# EAGLE design 2023_ROBOCON_A_SUB (EAGLE 9.6.2)
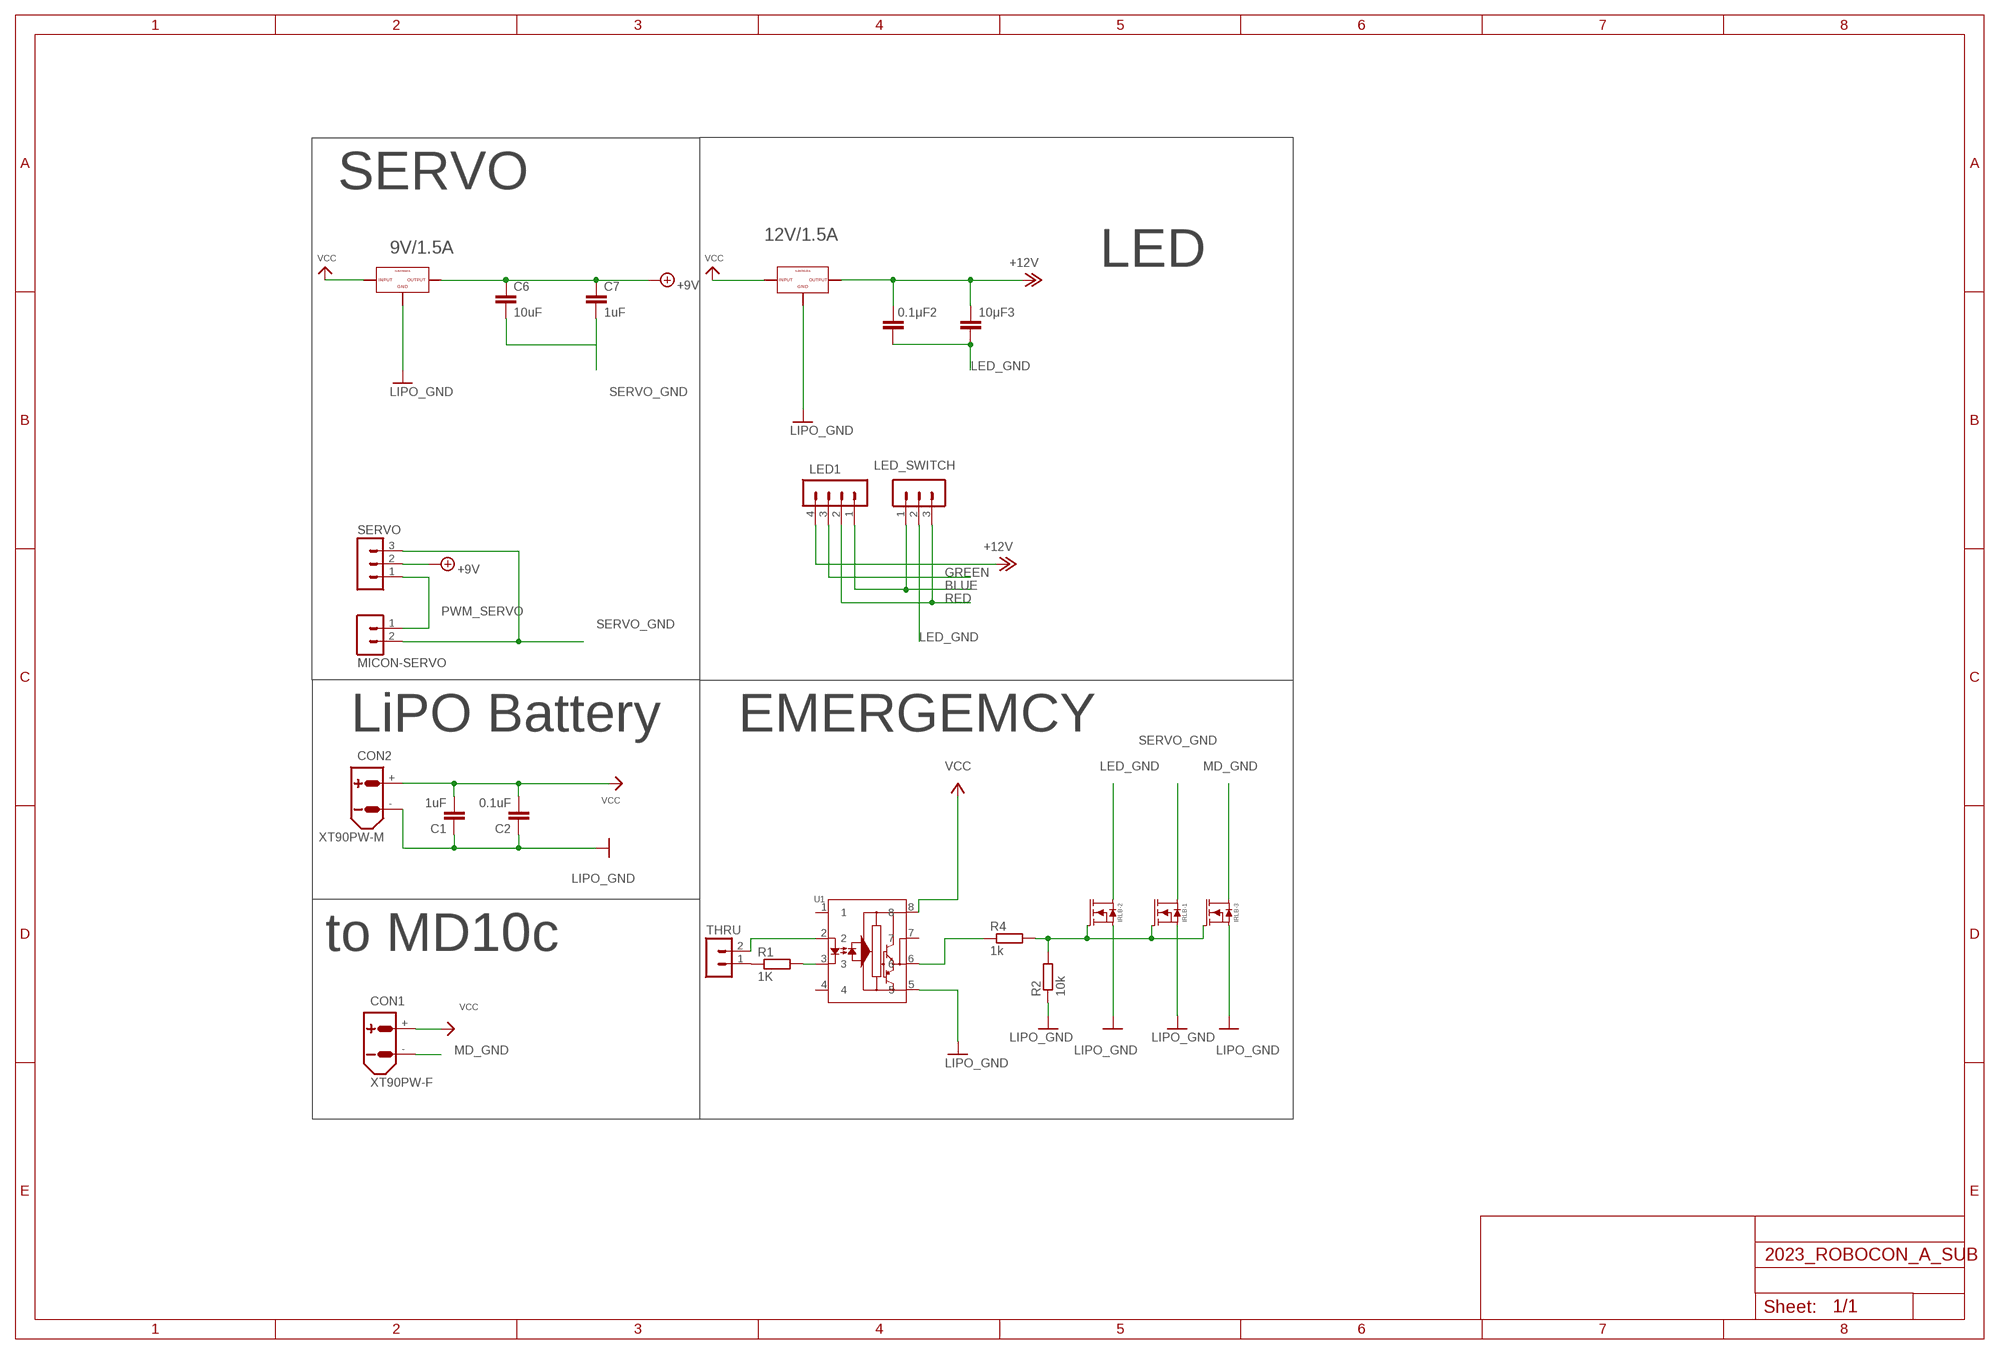
[diagram p0: schematic, sheet 1]

## Parts
0.1μF2  C2,5-3  [C2.5-3]
10μF3  C2,5-3  [C2.5-3]
C1  1uF  C2,5-3  [C2.5-3]
C2  0.1uF  C2,5-3  [C2.5-3]
C6  10uF  C2,5-3  [C2.5-3]
C7  1uF  C2,5-3  [C2.5-3]
CON1  XT90PW-F  [XT90PW-F]
CON2  XT90PW-M  [XT90PW-M]
IRLB-1  IRLB3813STAND  [TO-220AB-STAND]
IRLB-2  IRLB3813STAND  [TO-220AB-STAND]
IRLB-3  IRLB3813STAND  [TO-220AB-STAND]
LED1  04-JST  [B4B-XH]
LED_SWITCH  03-JST  [B3B-XH]
MICON-SERVO  02-JST  [B2B-XH]
R1  1K  R-EU_0204/5  [0204/5]
R2  10k  R-EU_0207/7  [0207/7]
R4  1k  R-EU_0207/7  [0207/7]
SERVO  03-JST  [B3B-XH]
THRU  02-JST  [B2B-XH]
U1  TLP-250  [DIP8_TLP250_6P4X9P66_TOS]
U$4  NJM7812FA  [NJM7812FA]
U$7  NJM7809FA  [NJM7809FA]

## Nets
+9V: C6.1 C7.1 SERVO.2 U$7.OUTPUT
+12V: 0.1μF2.1 10μF3.1 LED1.4 U$4.OUTPUT
BLUE: LED1.1 LED_SWITCH.1
GND: C1.1 C2.1 CON2.- IRLB-1.S IRLB-2.S IRLB-3.S R2.1 U1.5 U$4.GND U$7.GND ; supply symbol labelled LIPO_GND
GREEN: LED1.3
LED_GND: 0.1μF2.2 10μF3.2 IRLB-2.D LED_SWITCH.2
MD_GND: CON1.- IRLB-3.D
N$2: R1.1 THRU.1
N$4: R4.1 U1.6
N$5: R1.2 U1.3
N$7: IRLB-1.G IRLB-2.G IRLB-3.G R2.2 R4.2
N$10: THRU.2 U1.2
PWM_SERVO: MICON-SERVO.1 SERVO.1
RED: LED1.2 LED_SWITCH.3
SERVO_GND: C6.2 C7.2 IRLB-1.D MICON-SERVO.2 SERVO.3
VCC: C1.2 C2.2 CON1.+ CON2.+ U1.8 U$4.INPUT U$7.INPUT
Unconnected: U1.1 U1.4 U1.7

## Notes on the sheet
- SERVO
- 12V/1.5A
- 9V/1.5A
- LED
- LiPO Battery | EMERGEMCY
- to MD10c

## Library data of the parts
0.1μF2 10μF3 C1 C2 C6 C7 = capacitor-wima:C: CAPACITOR naming: grid - package width
CON1 CON2 = amass:XT90: AMASS XT90 connector Store in Japan AMASS XT90 connector <https://szc.jp/ams-xt90>
IRLB-1-IRLB-3 = OKUDA_libraries:IRLB3813
LED1 = con-jst-xh_1:04-JST: JST CONNECTOR
LED_SWITCH = con-jst-xh_1:03-JST: JST CONNECTOR
MICON-SERVO = con-jst-xh (4):02-JST: JST CONNECTOR
R1 R2 R4 = resistor:R-EU_: RESISTOR, European symbol
SERVO = con-jst-xh (4):03-JST: JST CONNECTOR
THRU = con-jst-xh_1:02-JST: JST CONNECTOR
U1 = tlp250:TLP-250; COPYRIGHT: Copyright (C) 2023 Ultra Librarian. All rights reserved.; MANUFACTURER_PART_NUMBER: TLP-250; MFR_NAME: Toshiba Electronic Devices & Storage Corp.
U$4 = NJM7812FA:NJM7812FA
U$7 = NJM7809FA:NJM7809FA

## Board
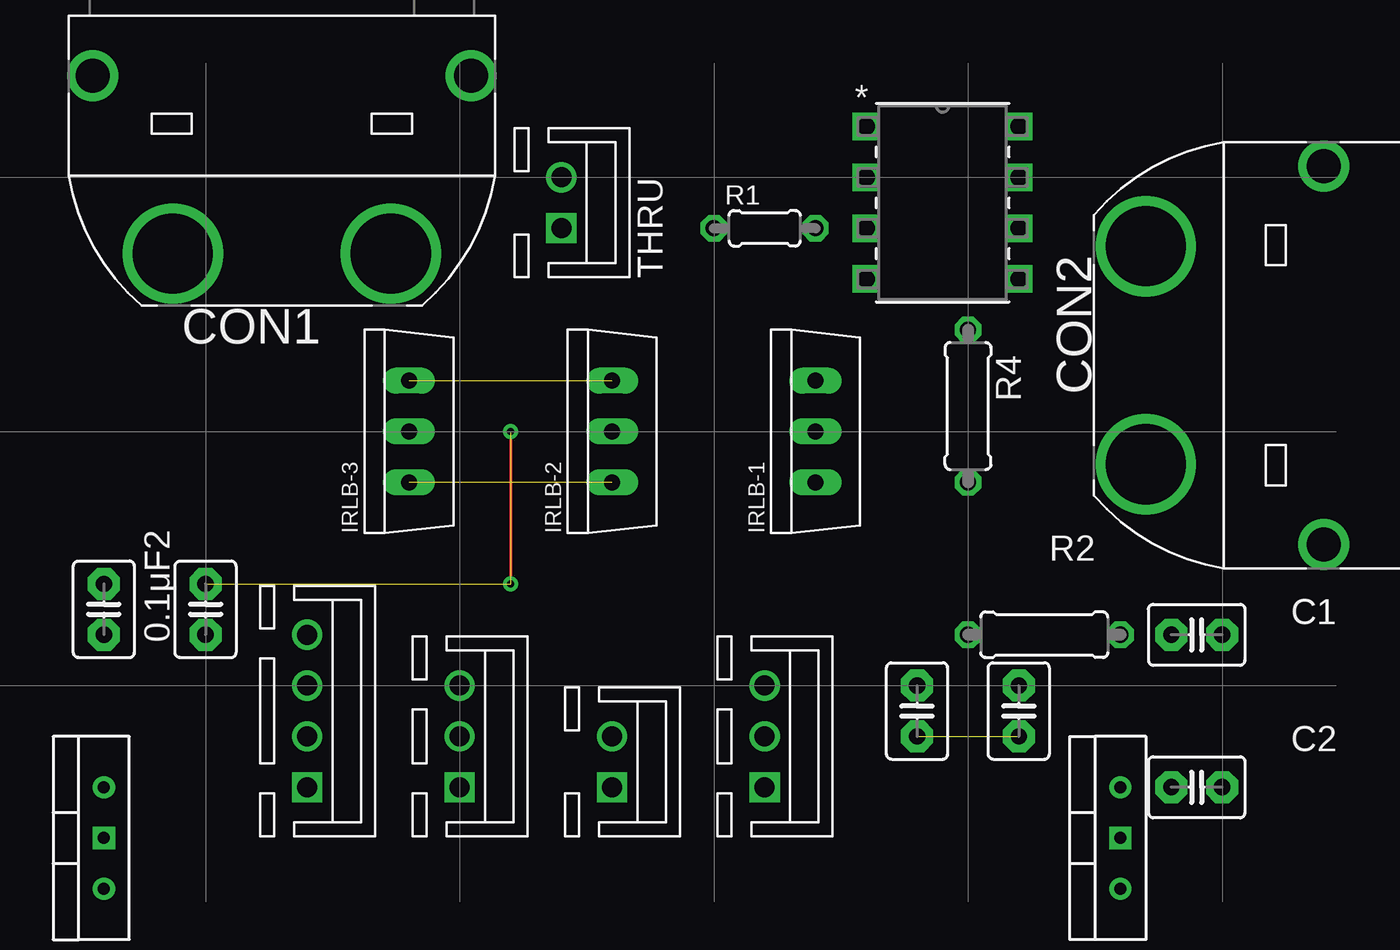
[diagram p1: board, top side]
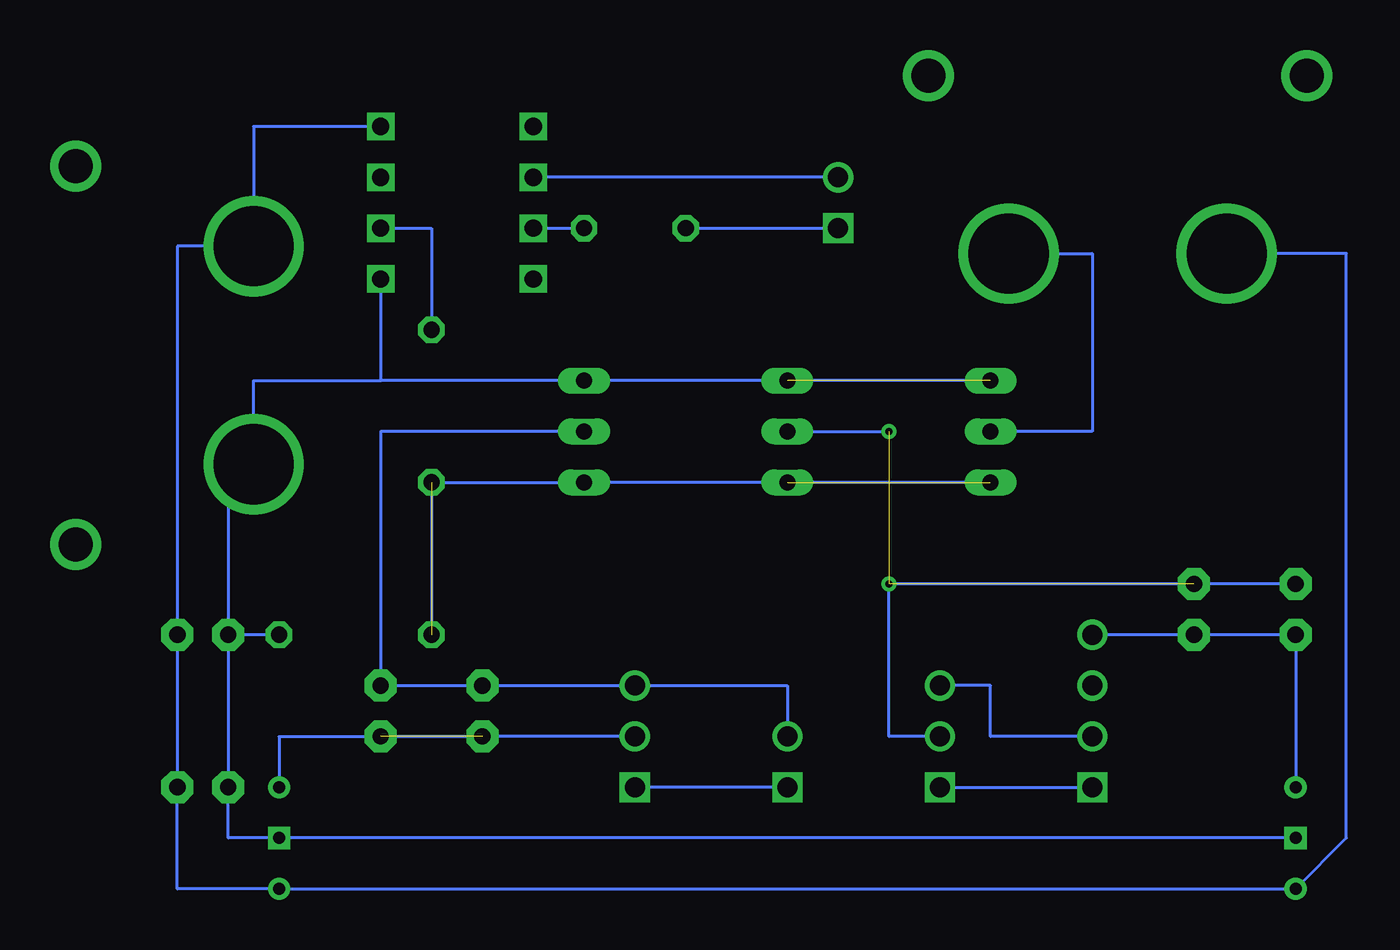
[diagram p2: board, bottom side, seen from below]

No outline drawn. Coordinates in mm, seen from the top.
Copper layers (1*16): Top 0.035mm / dielectric 1.5mm / Bottom 0.035mm
Design rules "default": minimum track width 6mil, minimum drill 0.35mm, track to track 6mil, track to pad 6mil, pad to pad 6mil, via to via 6mil, smd to smd 6mil, copper to edge 40mil, drill to drill 6mil, minimum pad ring 10mil, minimum via ring 8mil, stop-mask expansion 4mil, vias tented up to drill 0mil, thermal gap 10mil

### Footprints (pad centres in the part's own frame; a part is rotated, then mirrored left to right if it is on the bottom)
C2.5-3 = drill 0.813 pad 1.6 octagon: 1 -1.27,0; 2 1.27,0
XT90PW-F = drill 4: + -5.45,0; - 5.45,0 | drill 1.7: P$3 -9.45,8.9; P$4 9.45,8.9
XT90PW-M = drill 4: + -5.45,0; - 5.45,0 | drill 1.7: P$3 -9.45,8.9; P$4 9.45,8.9
TO-220AB-STAND = drill 0.8 long: D 0,0; G -2.54,0; S 2.54,0
B4B-XH = drill 1 square: 1 3.81,0 | drill 1: 2 1.27,0; 3 -1.27,0; 4 -3.81,0
B3B-XH = drill 1 square: 1 2.54,0 | drill 1: 2 0,0; 3 -2.54,0
B2B-XH = drill 1 square: 1 1.27,0 | drill 1: 2 -1.27,0
0204/5 = drill 0.813 octagon: 1 -2.54,0; 2 2.54,0
0207/7 = drill 0.813 octagon: 1 -3.81,0; 2 3.81,0
DIP8_TLP250_6P4X9P66_TOS = drill 0.864 pad 1.372 square: 1 0,0; 2 0,-2.54; 3 0,-5.08; 4 0,-7.62; 5 7.62,-7.62; 6 7.62,-5.08; 7 7.62,-2.54; 8 7.62,0
NJM7812FA = drill 0.6 square: GND 0,0 | drill 0.6: INPUT -2.54,0; OUTPUT 2.54,0
NJM7809FA = drill 0.6 square: GND 0,0 | drill 0.6: INPUT -2.54,0; OUTPUT 2.54,0

### Placement (x,y rotation side)
0.1μF2  158.75,27.94 90 top
10μF3  153.67,27.94 90 top
C1  208.28,26.67 0 top
C2  208.28,19.05 0 top
C6  199.39,22.86 90 top
C7  194.31,22.86 90 top
CON1  162.56,45.72 0 top
CON2  205.74,40.64 270 top
IRLB-1  189.23,36.83 90 top
IRLB-2  179.07,36.83 90 top
IRLB-3  168.91,36.83 90 top
LED1  163.83,22.86 270 top
LED_SWITCH  171.45,21.59 270 top
MICON-SERVO  179.07,20.32 270 top
R1  186.69,46.99 0 top
R2  200.66,26.67 180 top
R4  196.85,38.1 270 top
SERVO  186.69,21.59 270 top
THRU  176.53,48.26 270 top
U1  191.77,52.07 0 top
U$3  [TYPE.C]  146.05,11.43 0 top
U$4  153.67,16.51 90 top
U$7  204.47,16.51 90 top

### Tracks (layer width: path | path; a pad name or v marks a point on that pad's centre or on a via)
+9V  (1 unrouted)
  Bottom 0.152: U$7.OUTPUT 204.47,21.59 C7.1 SERVO.2
+12V
  Bottom 0.152: U$4.OUTPUT 10μF3.1 0.1μF2.1 LED1.4
BLUE
  Bottom 0.152: LED_SWITCH.1 LED1.1
GND  (1 unrouted)
  Bottom 0.152: U1.5 199.39,39.37 | 199.39,39.37 205.74,39.37 CON2.- 205.74,35.56 207.01,35.56 C1.1 | IRLB-3.S IRLB-1.S 199.39,39.37 | R2.1 C1.1 | C1.1 C2.1 207.01,16.51 U$7.GND U$4.GND
LED_GND  (via drill 0.35)  (2 unrouted)
  Top 0.152: v173.99,36.83 v173.99,29.21
  Bottom 0.152: LED_SWITCH.2 173.99,21.59 v173.99,29.21 0.1μF2.2 10μF3.2 | IRLB-2.D v173.99,36.83
MD_GND
  Bottom 0.152: IRLB-3.D 163.83,36.83 163.83,45.72 CON1.-
N$2
  Bottom 0.152: R1.1 THRU.1
N$4
  Bottom 0.152: U1.6 196.85,46.99 R4.1
N$5
  Bottom 0.152: U1.3 R1.2
N$7  (2 unrouted)
  Bottom 0.152: R2.2 R4.2 IRLB-1.G IRLB-3.G
N$10
  Bottom 0.152: THRU.2 U1.2
PWM_SERVO
  Bottom 0.152: MICON-SERVO.1 SERVO.1
RED
  Bottom 0.152: LED1.2 168.91,21.59 168.91,24.13 LED_SWITCH.3
SERVO_GND
  Bottom 0.152: MICON-SERVO.2 179.07,24.13 SERVO.3 C7.2 C6.2 199.39,36.83 IRLB-1.D
VCC
  Bottom 0.152: U1.8 205.74,52.07 CON2.+ | CON2.+ 207.26,46.09 | CON2.+ 209.55,46.09 C1.2 C2.2 209.55,13.97 U$7.INPUT U$4.INPUT 151.13,16.51 151.13,45.72 CON1.+